# EAGLE design Voltage_Regulator (EAGLE 7.2.0)
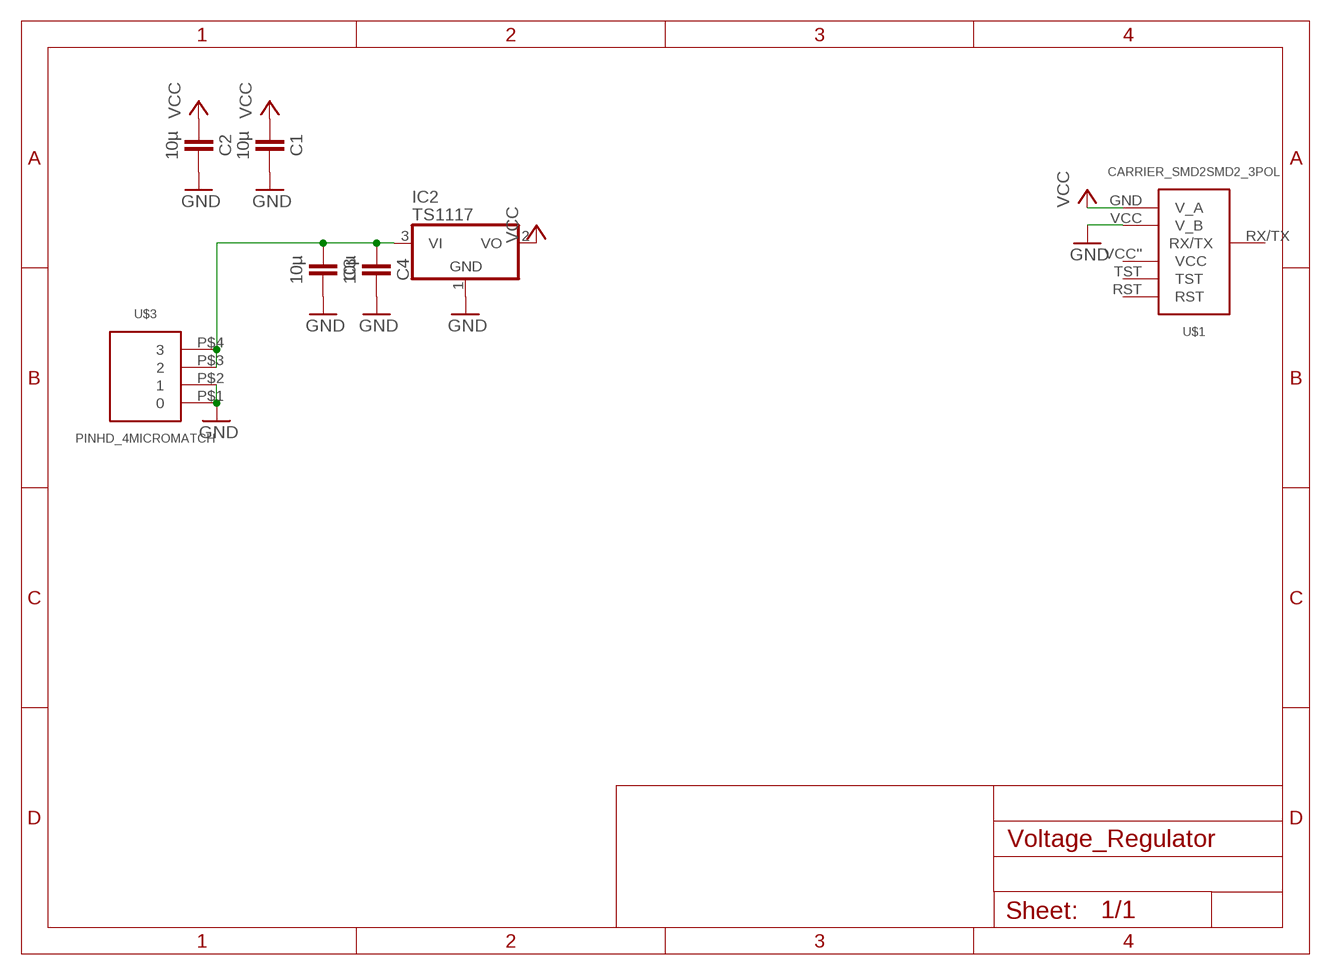
[diagram p0: schematic, sheet 1]

## Parts
C1  10µ  CAPACITOR  [603]
C2  10µ  CAPACITOR  [603]
C3  10µ  CAPACITOR  [603]
C4  10µ  CAPACITOR  [603]
IC2  TS1117  [SOT223]
U$1  CARRIER_SMD2SMD2_3POL  [CARRIER_SMD2_3POL]
U$3  PINHD_4MICROMATCH  [MICROMATCH4P0L]

## Nets
GND: C1.2 C2.2 C3.2 C4.2 IC2.1(GND) U$1.VCC(V_B) U$3.P$1 U$3.P$2
N$2: C3.1 C4.1 IC2.3(VI) U$3.P$3 U$3.P$4
VCC: C1.1 C2.1 IC2.2(VO) U$1.GND(V_A)
Unconnected: U$1.RST U$1.RX/TX U$1.TST U$1.VCC''(VCC)

## Library data of the parts
C1-C4 = thar:CAPACITOR
IC2 = welectronic:TS1117
U$1 = thar:CARRIER_SMD2
U$3 = thar:PINHD_4

## Board
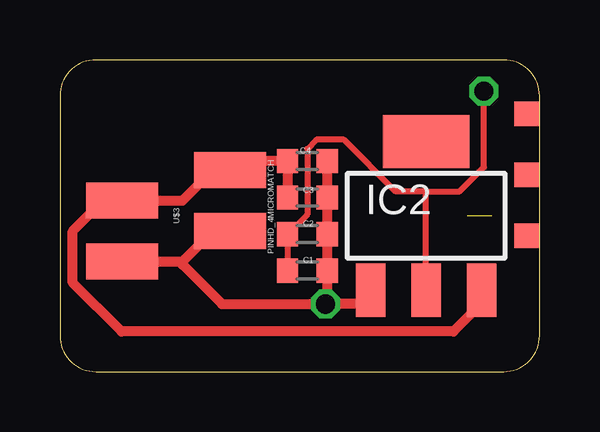
[diagram p1: board, top side]
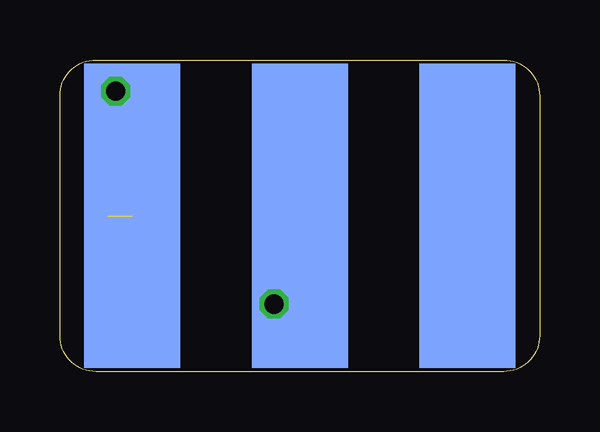
[diagram p2: board, bottom side, seen from below]

Size 20 x 13 mm. Coordinates in mm from the lower left corner, seen from the top.
Copper layers (1*16): Top 0.035mm / dielectric 1.5mm / Bottom 0.035mm
Design rules "Bilex DRU *": minimum track width 10mil, minimum drill 24mil, track to track 10mil, track to pad 10mil, pad to pad 10mil, via to via 10mil, smd to smd 10mil, copper to edge 1mil, drill to drill 8mil, minimum pad ring 10mil, minimum via ring 8mil, stop-mask expansion 4mil, vias tented up to drill 0mil, thermal gap 10mil

### Footprints (pad centres in the part's own frame; a part is rotated, then mirrored left to right if it is on the bottom)
603 = smd 0.889 x 1.016: 1 -0.826,0; 2 0.826,0
SOT223 = smd 1.219 x 2.235: 1 -2.311,-3.099; 2 0,-3.099; 3 2.311,-3.099 | smd 3.6 x 2.2: 4 0,3.099
CARRIER_SMD2_3POL = smd 4 x 12.7 bottom: GND -6.985,0; RX/TX 6.985,0; VCC 0,0 | smd 1.016 x 1.016: RST -9.461,0.826; TST -9.461,-1.714; VCC'' -9.461,-4.255
MICROMATCH4P0L = smd 1.5 x 3: P$1 -1.905,2.25; P$2 -0.635,-2.25; P$3 0.635,2.25; P$4 1.905,-2.25

### Placement (x,y rotation side)
C1  10.31,4.21 0 top
C2  10.31,5.74 0 top
C3  10.31,7.26 0 top
C4  10.31,8.78 0 top
IC2  15.27,6.5 0 top
U$1  10,6.5 180 top
U$3  4.85,6.5 90 top

### Tracks (layer width: path | path; a pad name or v marks a point on that pad's centre or on a via)
GND  (via drill 0.8)
  Top 0.254: IC2.1 12.7,3.98 12.6,4.08 12.6,3.32 12.98,2.94 12.98,2.81
  Top 0.406: U$3.P$1 5.11,4.59 | 5.11,4.59 6.25,5.74 | 6.25,5.74 6.98,5.74 U$3.P$2 6.38,5.86 6.25,5.74 | C4.2 C3.2 C2.2 C1.2 11.14,2.88 v11.08,2.81 | 12.6,4.08 12.6,3.2 12.98,2.81 v11.08,2.81 | 5.11,4.59 5.11,4.46 6.76,2.81 v11.08,2.81
  Bottom 0.406: U$1.VCC 11.71,6.5 v11.08,2.81
N$2
  Top 0.254: IC2.3 17.58,2.97
  Top 0.406: 6.63,8.28 6.25,8.28 5.11,7.13 U$3.P$3 1.81,7.13 0.54,5.86 0.54,3.7 2.57,1.67 16.41,1.67 17.58,2.84 17.58,2.97 | 6.63,8.28 6.98,8.28 U$3.P$4 | 6.63,8.28 7.14,8.78 C4.1 C3.1
VCC  (via drill 0.8)  (1 unrouted)
  Top 0.254: IC2.2 15.27,7.51 | 15.27,7.51 16.66,7.51 17.68,8.53 v17.68,11.7 | C1.1 C2.1 10.31,6.56 10.31,9.29 10.7,9.67 11.84,9.67 14,7.51 15.27,7.51
  Bottom 0.254: v17.68,11.7 18.06,6.56 18,6.5